# Altium schematic sheet switcher.SchDoc
size A4
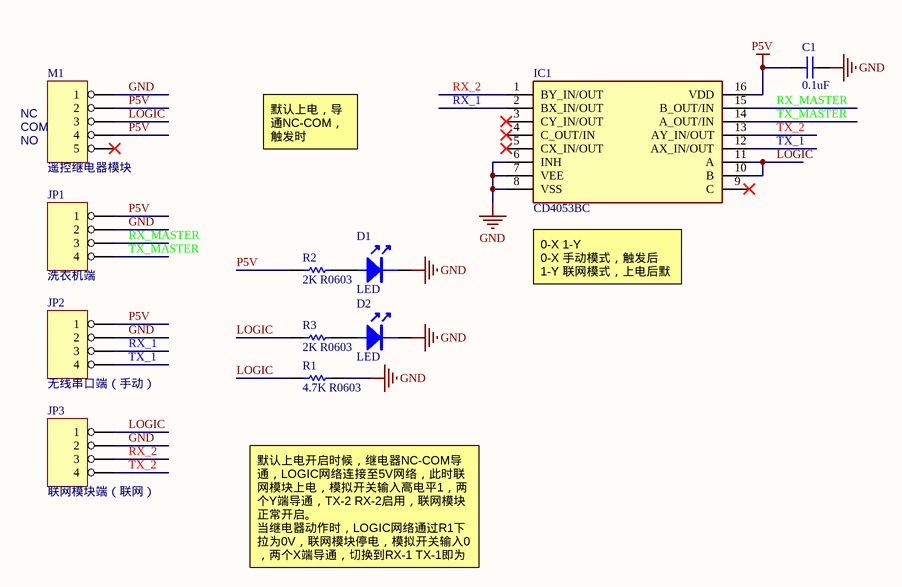
[diagram p0: switcher.SchDoc]

## Parts
C1  0.1uF  [0603_C]
D1  LED  [0603_LED]
D2  LED  [0603_LED]
IC1  CD4053BC  [SOIC-16]
JP1  洗衣机端  [header4]
JP2  无线串口端（手动）  [header4]
JP3  联网模块端（联网）  [header4]
M1  遥控继电器模块  [header5]
R1  4.7K R0603  [0603_R]
R2  2K R0603  [0603_R]
R3  2K R0603  [0603_R]

## Nets
GND: C1.2 D1.2(K) D2.2(K) IC1.6(INH) IC1.7(VEE) IC1.8(VSS) JP1.2 JP2.2 JP3.2 M1.1 R1.1
P5V: C1.1 IC1.16(VDD) JP1.1 JP2.1 M1.2 M1.4 R2.1
LOGIC: IC1.10(B) IC1.11(A) JP3.1 M1.3 R1.2 R3.1
RX_1: IC1.2(BX_IN/OUT) JP2.3
RX_2: IC1.1(BY_IN/OUT) JP3.3
RX_MASTER: IC1.15(B_OUT/IN) JP1.3
TX_1: IC1.12(AX_IN/OUT) JP2.4
TX_2: IC1.13(AY_IN/OUT) JP3.4
TX_MASTER: IC1.14(A_OUT/IN) JP1.4
NetD1_1: D1.1(A) R2.2
NetD2_1: D2.1(A) R3.2

Not connected (* = marked no-connect by the designer): IC1 3(CY_IN/OUT)* 4(C_OUT/IN)* 5(CX_IN/OUT)* 9(C)*; M1 5*

## Notes on the sheet
- NC
- (near M1) COM
- NO
- 默认上电，导通NC-COM，触发时NO-COM导通
- (near IC1) 0-X 1-Y
  0-X 手动模式，触发后
  1-Y 联网模式，上电后默认
- 默认上电开启时候，继电器NC-COM导通，LOGIC网络连接至5V网络，此时联网模块上电，模拟开关输入高电平1，两个Y端导通，TX-2 RX-2启用，联网模块正常开启。
  当继电器动作时，LOGIC网络通过R1下拉为0V，联网模块停电，模拟开关输入0，两个X端导通，切换到RX-1 TX-1即为手动模式。

## Library data of the parts
C1 = CAP: Capacitor; Value: 104; Published: 8-Jun-2000; LatestRevisionDate: 17-Jul-2002; LatestRevisionNote: Re-released for DXP Platform.; PackageReference: RAD-0.3; Publisher: Altium Limited
D1 D2 = LED: LED 发光二极管
IC1 = CD4053BC: Integrated Circuit; Manufacturer_Name: Texas Instruments; Datasheet Link: https://pdf1.alldatasheet.com/datasheet-pdf/view/8183/NSC/CD4053BC.html; Height: 5.08mm; Manufacturer_Part_Number: CD4053BC; Mouser Part Number: N/A; Mouser Price/Stock: https://www.mouser.com/Search/Refine.aspx?Keyword=N%2FA
JP1-JP3 = HEADER 4
M1 = HEADER 5
R1-R3 = RES: Resistor; Value: 1K; Published: 8-Jun-2000; Revision: July-2002: Re-released for DXP Platform.; Publisher: Altium Limited